# Altium schematic sheet LoRa_V.SchDoc
size C; SheetNumber: 1; SheetTotal: 3
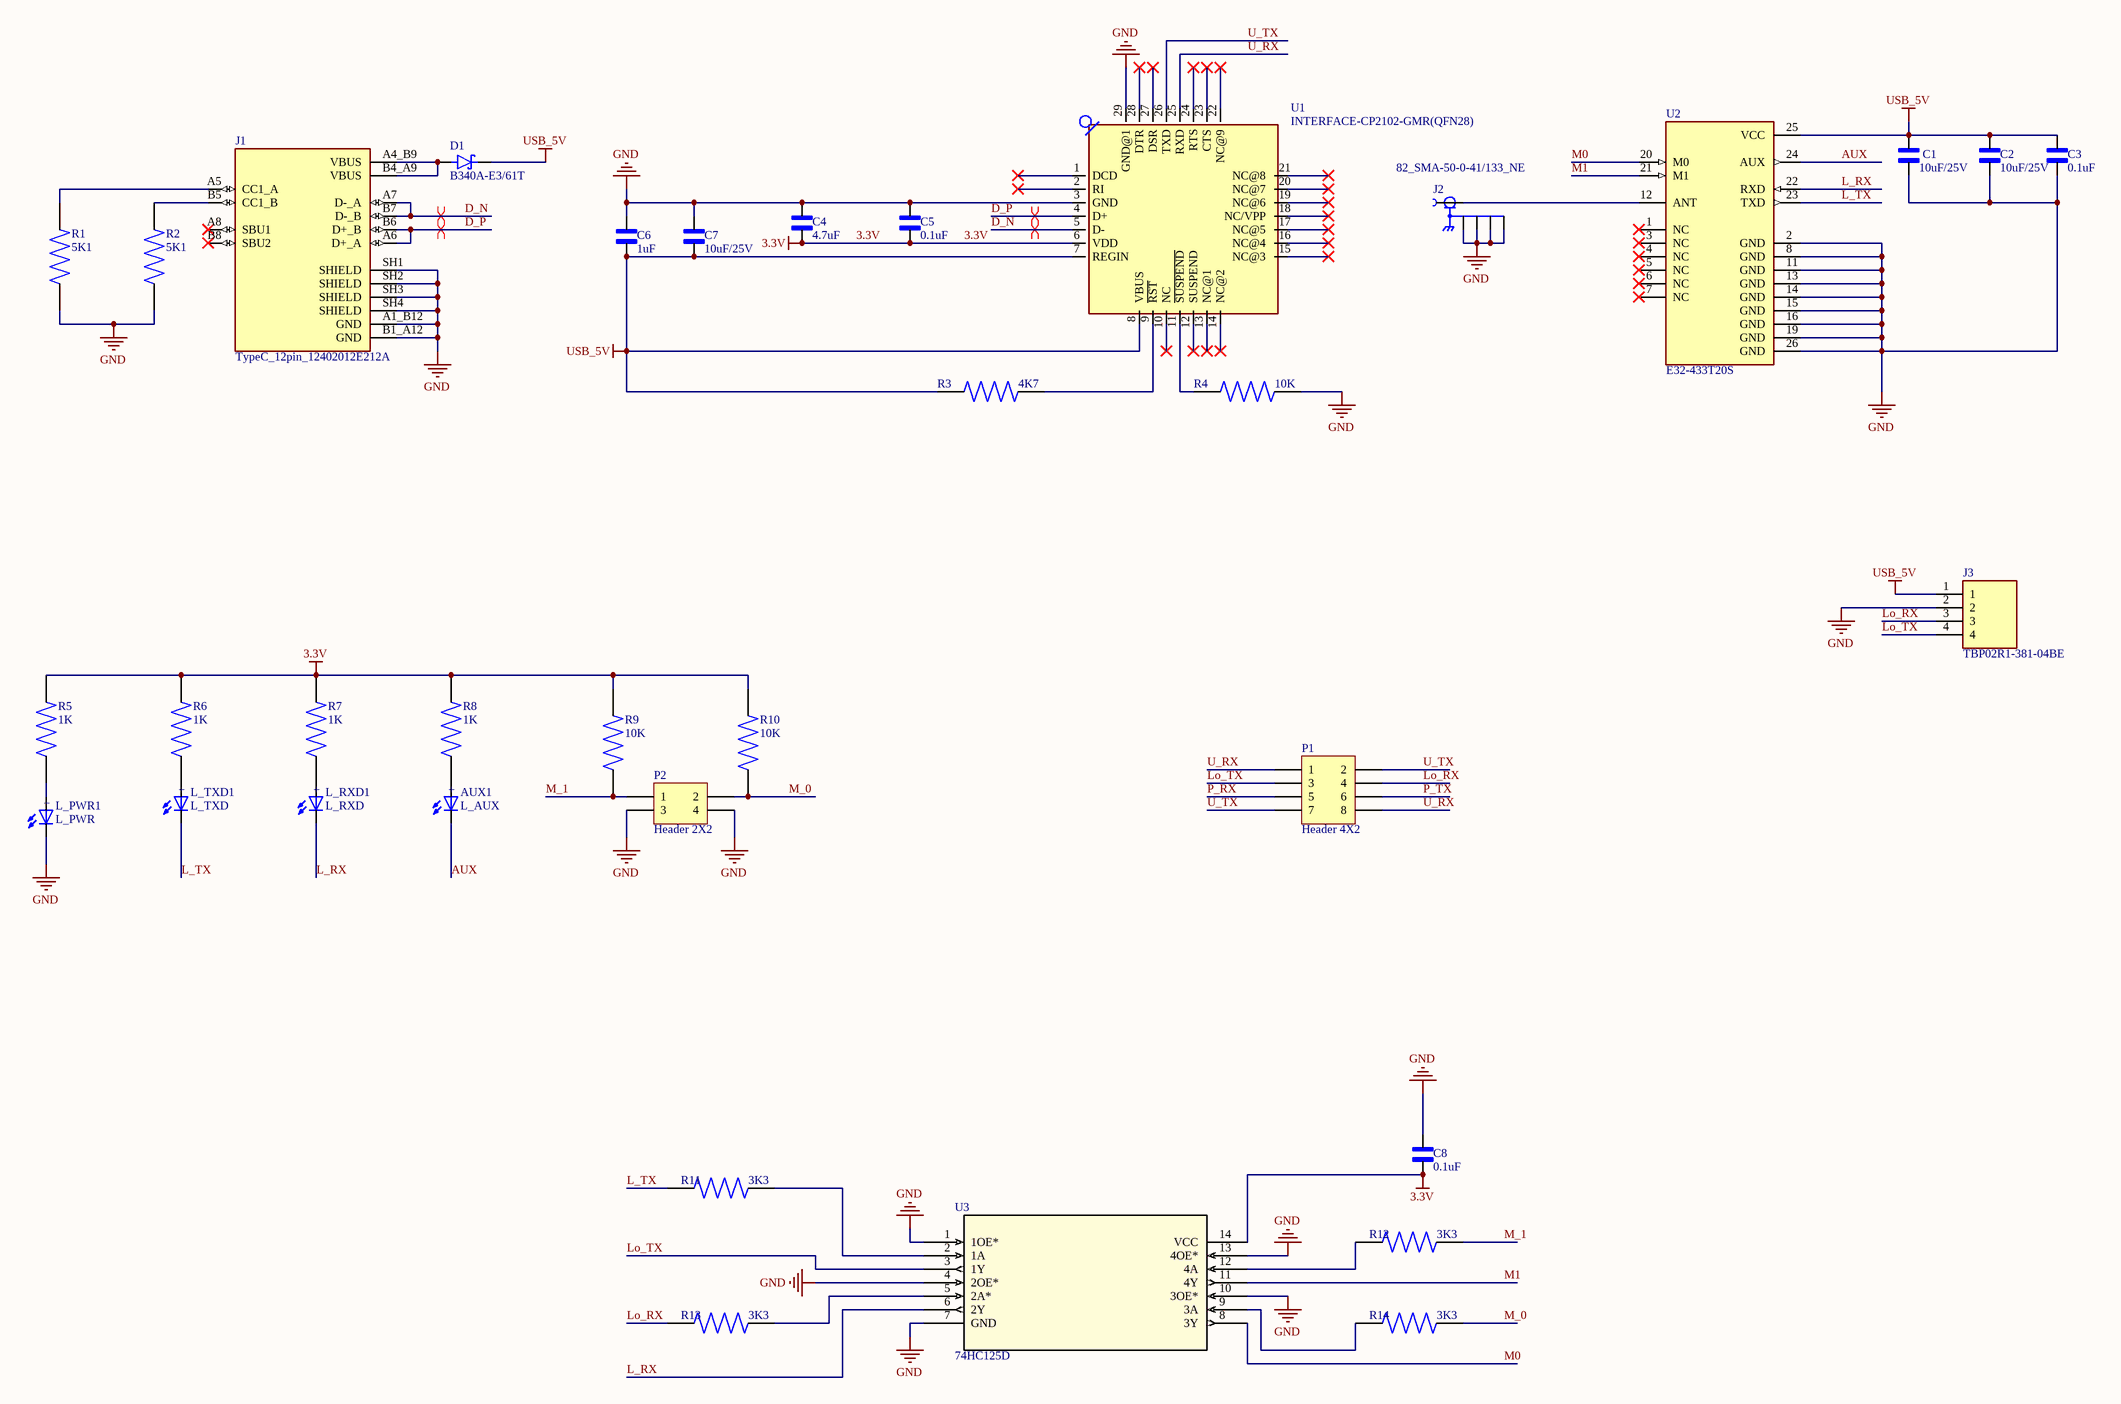
[diagram p0: LoRa_V.SchDoc]

## Parts
AUX1  L_AUX  [WL-SMCW_1206]
C1  10uF/25V  [CAPC1608X94N]
C2  10uF/25V  [CAPC1608X94N]
C3  0.1uF  [CAPC1608X94N]
C4  4.7uF  [CAPC1608X94N]
C5  0.1uF  [CAPC1608X94N]
C6  1uF  [CAPC1608X94N]
C7  10uF/25V  [CAPC1608X94N]
C8  0.1uF  [CAPC1608X94N]
D1  B340A-E3/61T  [DIOM5126X229N]
J1  TypeC_12pin_12402012E212A  [TypeC_12pin_12402012E212A]
J2  82_SMA-50-0-41/133_NE  [HUBER+SUHNER_82_SMA-50-0-41/133_NE]
J3  TBP02R1-381-04BE  [CUI_TBP02R1-381-04BE]
L_PWR1  L_PWR  [WL-SMCW_1206]
L_RXD1  L_RXD  [WL-SMCW_1206]
L_TXD1  L_TXD  [WL-SMCW_1206]
P1  Header 4X2  [HDR2X4]
P2  Header 2X2  [HDR2X2]
R1  5K1  [RES_ERJU03J474V]
R2  5K1  [RES_ERJU03J474V]
R3  4K7  [RES_ERJU03J474V]
R4  10K  [RES_ERJU03J474V]
R5  1K  [RES_ERJU03J474V]
R6  1K  [RES_ERJU03J474V]
R7  1K  [RES_ERJU03J474V]
R8  1K  [RES_ERJU03J474V]
R9  10K  [RES_ERJU03J474V]
R10  10K  [RES_ERJU03J474V]
R11  3K3  [RES_ERJU03J474V]
R12  3K3  [RES_ERJU03J474V]
R13  3K3  [RES_ERJU03J474V]
R14  3K3  [RES_ERJU03J474V]
U1  INTERFACE-CP2102-GMR(QFN28)  [QFN28G_0.5-5X5MM]
U2  E32-433T20S  [MODULE_E32-433T20S]
U3  74HC125D  [SOT108-1_NEX]

## Nets
3.3V: C4.1 C5.1 C8.2 R5.2 R6.2 R7.2 R8.2 R9.1 R10.1 U1.6(VDD) U3.14(VCC)
GND: C1.1 C2.1 C3.1 C4.2 C5.2 C6.2 C7.2 C8.1 J1.A1_B12(GND) J1.B1_A12(GND) J1.SH1(SHIELD) J1.SH2(SHIELD) J1.SH3(SHIELD) J1.SH4(SHIELD) J2.G1 J2.G2 J2.G3 J2.G4 J3.2 L_PWR1.1(NEG) P2.3 P2.4 R1.1 R2.1 R4.2 U1.3(GND) U1.29(GND@1) U2.2(GND) U2.8(GND) U2.11(GND) U2.13(GND) U2.14(GND) U2.15(GND) U2.16(GND) U2.19(GND) U2.26(GND) U3.1(1OE*) U3.4(2OE*) U3.7(GND) U3.10(3OE*) U3.13(4OE*)
USB_5V: C1.2 C2.2 C3.2 C6.1 C7.1 D1.C J3.1 R3.1 U1.7(REGIN) U1.8(VBUS) U2.25(VCC)
AUX: AUX1.1(NEG) U2.24(AUX)
D_N: J1.A7(D-_A) J1.B7(D-_B) U1.5(D-)
D_P: J1.A6(D+_A) J1.B6(D+_B) U1.4(D+)
L_RX: L_RXD1.1(NEG) U2.22(RXD) U3.6(2Y)
L_TX: L_TXD1.1(NEG) R11.1 U2.23(TXD)
Lo_RX: J3.3 P1.4 R13.1
Lo_TX: J3.4 P1.3 U3.3(1Y)
M0: U2.20(M0) U3.8(3Y)
M1: U2.21(M1) U3.11(4Y)
M_0: P2.2 R10.2 R14.2
M_1: P2.1 R9.2 R12.2
P_RX: P1.5
P_TX: P1.6
U_RX: P1.1 P1.8 U1.25(RXD)
U_TX: P1.2 P1.7 U1.26(TXD)
NetAUX1_2: AUX1.2(POS) R8.1
NetD1_A: D1.A J1.A4_B9(VBUS) J1.B4_A9(VBUS)
NetJ1_A5: J1.A5(CC1_A) R1.2
NetJ1_B5: J1.B5(CC1_B) R2.2
NetJ2_1: J2.1 U2.12(ANT)
NetL_PWR1_2: L_PWR1.2(POS) R5.1
NetL_RXD1_2: L_RXD1.2(POS) R7.1
NetL_TXD1_2: L_TXD1.2(POS) R6.1
NetR3_2: R3.2 U1.9(~{RST})
NetR4_1: R4.1 U1.11(~{SUSPEND})
NetR11_2: R11.2 U3.2(1A)
NetR12_1: R12.1 U3.12(4A)
NetR13_2: R13.2 U3.5(2A*)
NetR14_1: R14.1 U3.9(3A)

Not connected (* = marked no-connect by the designer): J1 A8(SBU1)* B8(SBU2)*; U1 1(DCD)* 2(RI)* 10(NC)* 12(SUSPEND)* 13(NC@1)* 14(NC@2)* 15(NC@3)* 16(NC@4)* 17(NC@5)* 18(NC/VPP)* 19(NC@6)* 20(NC@7)* 21(NC@8)* 22(NC@9)* 23(CTS)* 24(RTS)* 27(DSR)* 28(DTR)*; U2 1(NC)* 3(NC)* 4(NC)* 5(NC)* 6(NC)* 7(NC)*

## Layout directives
differential pair: D_N, D_P

## Notes on the sheet
- (in symbol WL-SMCW_1206) +

## Library data of the parts
AUX1 L_PWR1 L_RXD1 L_TXD1 = WL-SMCW_1206: 1206, Blue Typ.(@20mA): 470nm, 145mcd, 3.2V, 140Â° InGaN; MF: Wurth Electronics; MP: 150120BS75000; SnapEDA_Link: https://www.snapeda.com/parts/150120BS75000/Wurth+Electronics/view-part/?ref=snap; Package: 1206 Wurth Electronics; Value: *; Check_prices: https://www.snapeda.com/parts/150120BS75000/Wurth+Electronics/view-part/?ref=eda
C1-C8 = cap_0603_VJ0603D3R9DXCAP: cap 0603 (1608 Metric); MF: Vishay Vitramon; SnapEDA_Link: https://www.snapeda.com/parts/VJ0603D3R9DXCAP/Vishay/view-part/?ref=snap; Package: 1608 Vishay Vitramon; Value: *; MP: VJ0603D3R9DXCAP; Check_prices: https://www.snapeda.com/parts/VJ0603D3R9DXCAP/Vishay/view-part/?ref=eda
D1 = B340A-E3/61T: Diode Schottky 40 V 3A Surface Mount DO-214AC (SMA); MF: Vishay Semiconductor; SnapEDA_Link: https://www.snapeda.com/parts/B340A-E3/61T/Vishay/view-part/?ref=snap; Package: DO-214 Vishay Semiconductor; Value: *; MP: B340A-E3/61T; Check_prices: https://www.snapeda.com/parts/B340A-E3/61T/Vishay/view-part/?ref=eda
J1 = TypeC_12pin_12402012E212A: USB2.0, Type C, Top mount, CH 1.68mm, Dual Row SMT; MF: Amphenol ICC (Commercial Products); MP: 12402012E212A; Price: None; Package: None; Availability: In Stock; SnapEDA_Link: https://www.snapeda.com/parts/12402012E212A/Amphenol/view-part/?ref=snap; Value: *; Check_prices: https://www.snapeda.com/parts/12402012E212A/Amphenol/view-part/?ref=eda; Purchase-URL: https://pricing.snapeda.com/search/part/12402012E212A/?ref=eda
J2 = 82_SMA-50-0-41/133_NE: RF Connectors / Coaxial Connectors, Straight Pcb Jack | HUBER+SUHNER 82_SMA-50-0-41/133_NE; SnapEDA_Link: https://www.snapeda.com/parts/82_SMA-50-0-41/133_NE/Huber%252BSuhner/view-part/?ref=snap; Package: None; Value: *; MF: HUBER+SUHNER; MP: 82_SMA-50-0-41/133_NE; Check_prices: https://www.snapeda.com/parts/82_SMA-50-0-41/133_NE/Huber%252BSuhner/view-part/?ref=eda
J3 = TBP02R1-381-04BE: 2~24 Poles, Pluggable,Receptacle, Horizontal, 3.81 Pitch, Terminal Block Connector; MF: Same Sky; SnapEDA_Link: https://www.snapeda.com/parts/TBP02R1-381-04BE/Same+Sky/view-part/?ref=snap; Package: None; Value: *; MP: TBP02R1-381-04BE; Check_prices: https://www.snapeda.com/parts/TBP02R1-381-04BE/Same+Sky/view-part/?ref=eda
P1 = Header 4X2: Header, 4-Pin, Dual row; LatestRevisionDate: 17-Jul-2002; LatestRevisionNote: Re-released for DXP Platform.; Publisher: Altium Limited
P2 = Header 2X2: Header, 2-Pin, Dual row; LatestRevisionDate: 17-Jul-2002; LatestRevisionNote: Re-released for DXP Platform.; Publisher: Altium Limited
R1-R14 = res_0603_ERJU03J474V: 0603 Anti-Sulfurated; MF: Panasonic; SnapEDA_Link: https://www.snapeda.com/parts/ERJU03J474V/Panasonic/view-part/?ref=snap; Package: 1608-2 Panasonic; Value: *; MP: ERJU03J474V; Check_prices: https://www.snapeda.com/parts/ERJU03J474V/Panasonic/view-part/?ref=eda
U1 = INTERFACE-CP2102-GMR(QFN28): USB Bridge, USB to UART USB 2.0 UART Interface 28-QFN (5x5); MF: Silicon; Price: None; Availability: In Stock; MP: CP2102-GMR; Package: VFQFN-28 Vishay Siliconix; SnapEDA_Link: https://www.snapeda.com/parts/CP2102-GMR/Silicon+Labs/view-part/?ref=snap; Check_prices: https://www.snapeda.com/parts/CP2102-GMR/Silicon+Labs/view-part/?ref=eda; Value: *; Purchase-URL: https://pricing.snapeda.com/search/part/CP2102-GMR/?ref=eda
U2 = E32-433T20S: Wireless serial port module (UART); MF: EBYTE; Check_prices: https://www.snapeda.com/parts/E32-433T20S/EBYTE/view-part/?ref=eda; Package: Package; MP: E32-433T20S; Value: *; SnapEDA_Link: https://www.snapeda.com/parts/E32-433T20S/EBYTE/view-part/?ref=snap; Price: None; Availability: Not in stock
U3 = 74HC125D: Description; Manufacturer_Name: Nexperia; Copyright: Copyright (C) 2025 Ultra Librarian. All rights reserved.; Manufacturer_Part_Number: 74HC125D; RefDes: RefDes; Type: Type